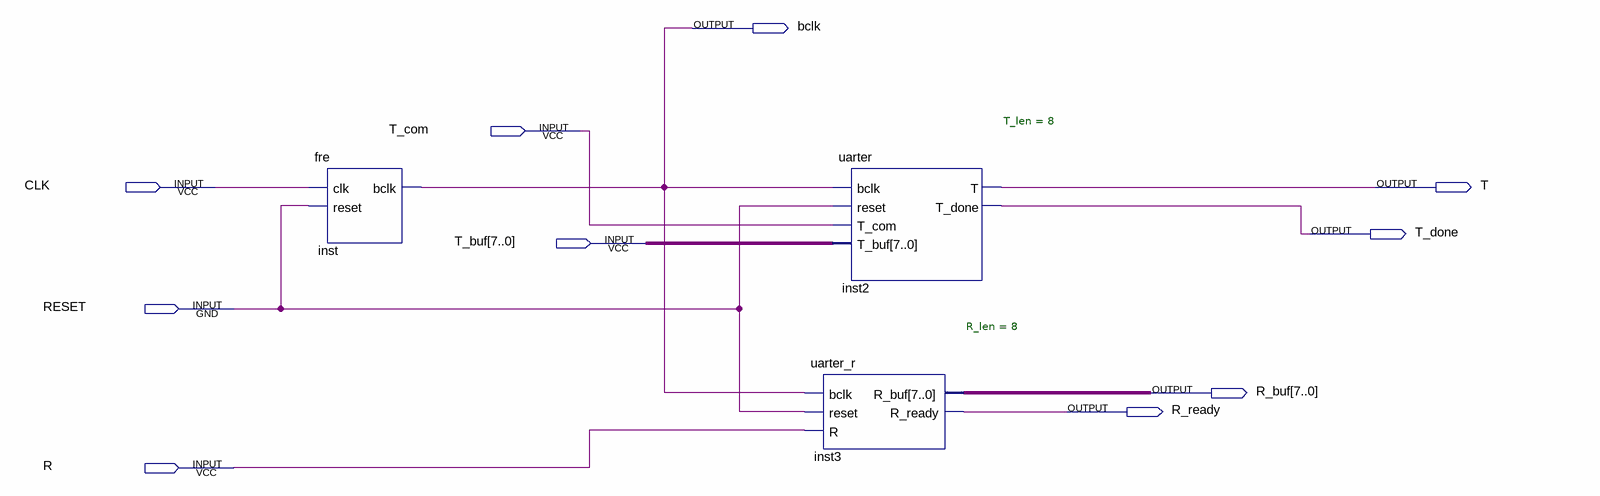
[diagram p0: schematic sheet]
// Quartus schematic new_all.bdf as structural Verilog: 3 symbols, 10 pins
module new_all (
  input  T_com,
  input  CLK,
  input  [7:0] T_buf,
  input  RESET,
  input  R,
  output bclk,
  output T,
  output T_done,
  output [7:0] R_buf,
  output R_ready
);

  fre inst (.clk(CLK), .reset(RESET), .bclk(bclk));
  uarter #(.T_len(8)) inst2 (.bclk(bclk), .reset(RESET), .T_com(T_com), .T_buf(T_buf), .T(T), .T_done(T_done));
  uarter_r #(.R_len(8)) inst3 (.bclk(bclk), .reset(RESET), .R(R), .R_buf(R_buf), .R_ready(R_ready));
endmodule
